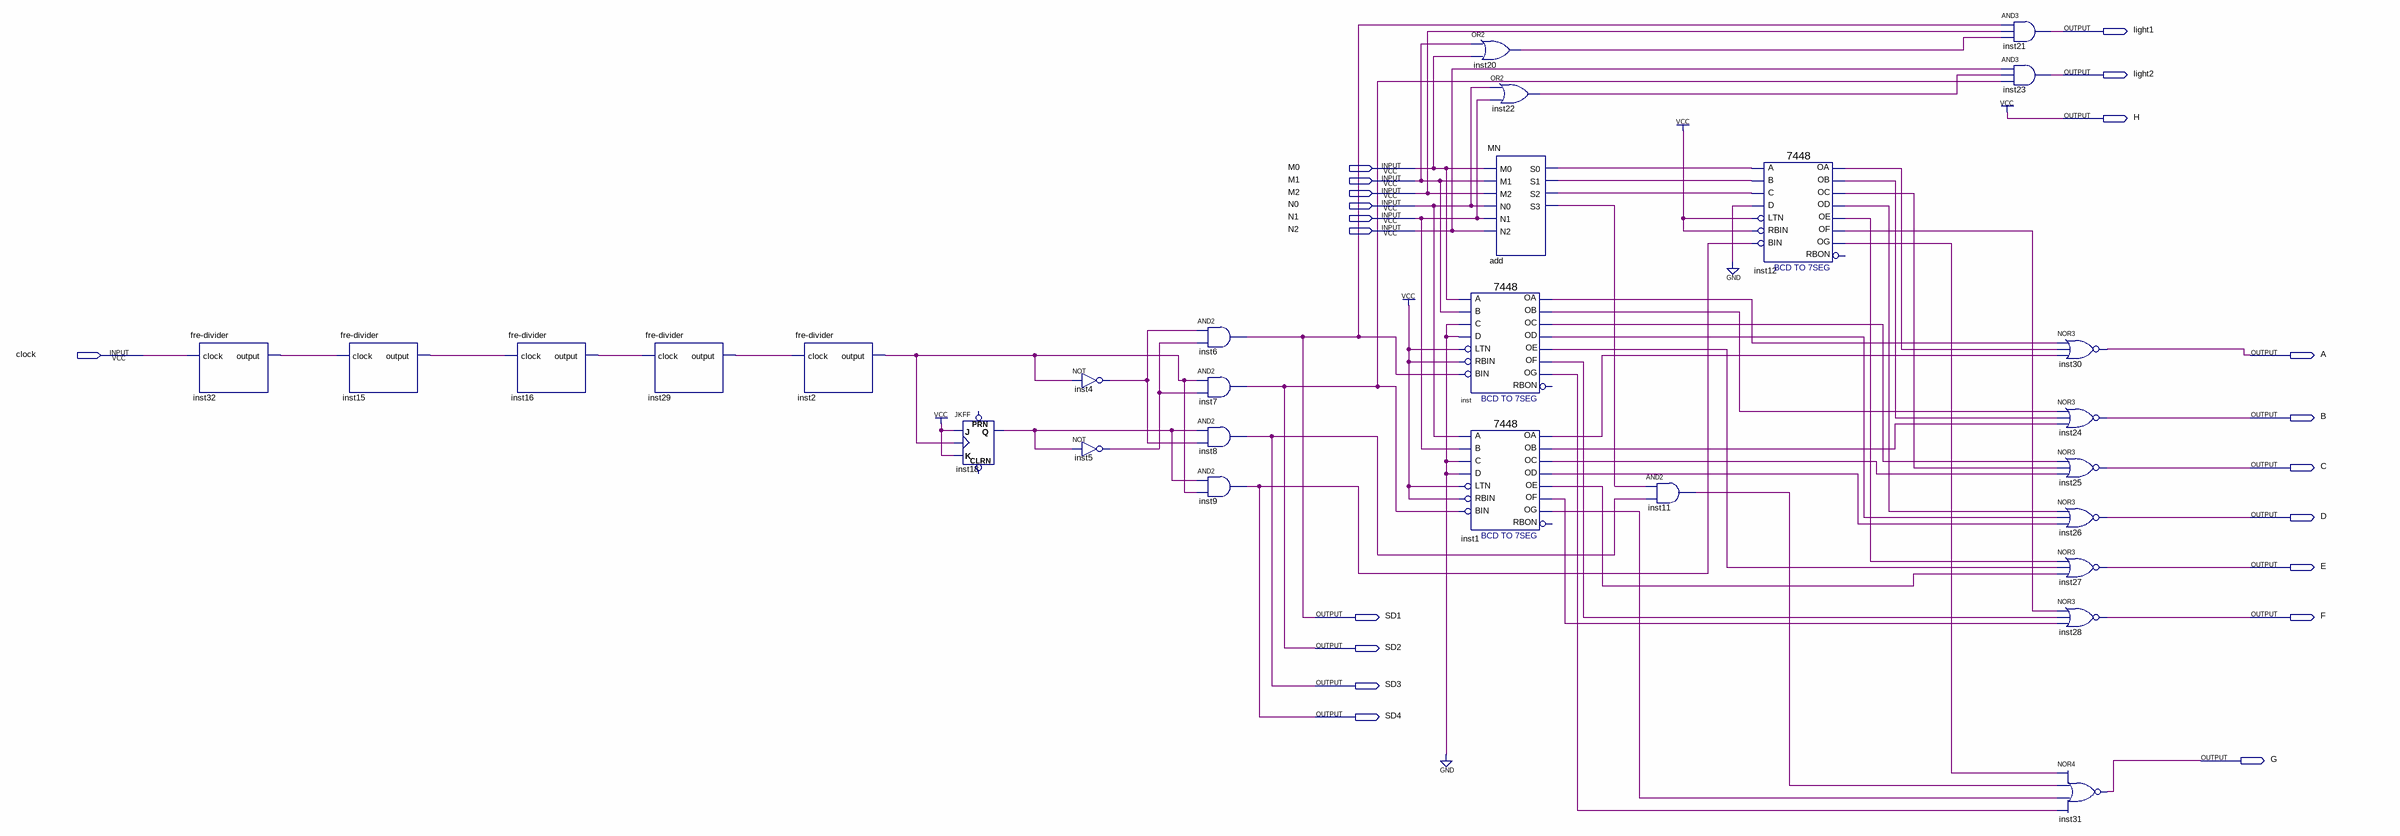
[diagram p0: schematic sheet]
// Quartus schematic main.bdf as structural Verilog: 28 symbols, 21 pins
module main (
  input  M0,
  input  M1,
  input  M2,
  input  N0,
  input  N1,
  input  N2,
  input  clock,
  output light1,
  output light2,
  output H,
  output A,
  output B,
  output C,
  output D,
  output E,
  output SD1,
  output F,
  output SD2,
  output SD3,
  output SD4,
  output G
);

  wire add_s0, add_s1, add_s2, add_s3, inst1_oa, inst1_ob, inst1_oc, inst1_od, inst1_oe, inst1_of, inst1_og,
       inst2_output, inst4_out, inst5_out, inst11_out, inst12_oa, inst12_ob, inst12_oc, inst12_od, inst12_oe,
       inst12_of, inst12_og, inst15_output, inst16_output, inst18_q, inst20_out, inst22_out, inst29_output,
       inst32_output, inst_oa, inst_ob, inst_oc, inst_od, inst_oe, inst_of, inst_og;

  \fre-divider  inst32 (.clock(clock), .\output (inst32_output));
  \fre-divider  inst15 (.clock(inst32_output), .\output (inst15_output));
  \fre-divider  inst16 (.clock(inst15_output), .\output (inst16_output));
  \fre-divider  inst29 (.clock(inst16_output), .\output (inst29_output));
  \fre-divider  inst2 (.clock(inst29_output), .\output (inst2_output));
  JKFF inst18 (.K(1'b1), .J(1'b1), .CLK(inst2_output), .Q(inst18_q));  // open: PRN, CLRN
  not inst4 (inst4_out, inst2_output);
  not inst5 (inst5_out, inst18_q);
  and inst6 (SD1, inst4_out, inst5_out);
  and inst7 (SD2, inst2_output, inst5_out);
  and inst8 (SD3, inst18_q, inst4_out);
  and inst9 (SD4, inst18_q, inst2_output);
  or inst20 (inst20_out, M1, M0);
  \7448  inst (
    .A(M0), .C(1'b0), .D(1'b0), .B(M1), .RBIN(1'b1), .BIN(SD1), .LTN(1'b1), .OC(inst_oc), .OE(inst_oe),
    .OD(inst_od), .OF(inst_of), .OG(inst_og), .OB(inst_ob), .OA(inst_oa));  // open: RBON
  \7448  inst1 (
    .A(N0), .C(1'b0), .D(1'b0), .B(N1), .RBIN(1'b1), .BIN(SD2), .LTN(1'b1), .OC(inst1_oc), .OE(inst1_oe),
    .OD(inst1_od), .OF(inst1_of), .OG(inst1_og), .OB(inst1_ob), .OA(inst1_oa));  // open: RBON
  or inst22 (inst22_out, N0, N1);
  MN add (.M0(M0), .M1(M1), .M2(M2), .N0(N0), .N1(N1), .N2(N2), .S0(add_s0), .S1(add_s1), .S2(add_s2), .S3(add_s3));
  and inst11 (inst11_out, add_s3, SD3);
  \7448  inst12 (
    .A(add_s0), .C(add_s2), .D(1'b0), .B(add_s1), .RBIN(1'b1), .BIN(SD4), .LTN(1'b1), .OC(inst12_oc),
    .OE(inst12_oe), .OD(inst12_od), .OF(inst12_of), .OG(inst12_og), .OB(inst12_ob), .OA(inst12_oa));  // open: RBON
  and inst21 (light1, SD1, M2, inst20_out);
  and inst23 (light2, N2, inst22_out, SD2);
  nor inst30 (A, inst_oa, inst12_oa, inst1_oa);
  nor inst24 (B, inst_ob, inst12_ob, inst1_ob);
  nor inst25 (C, inst_oc, inst12_oc, inst1_oc);
  nor inst26 (D, inst12_od, inst_od, inst1_od);
  nor inst27 (E, inst12_oe, inst_oe, inst1_oe);
  nor inst28 (F, inst12_of, inst_of, inst1_of);
  nor inst31 (G, inst12_og, inst11_out, inst1_og, inst_og);

  assign H = 1'b1;
endmodule
